# EasyEDA Pro project ProPrj_TC375_2025-11-27.epro, schematic SAL
Board Name: Board1; Create Date: 2025-11-19; Page Name: P1; Project Name: TC375; Schematic Name: SAL; Update Date: 2025-11-21; Company: 嘉立创EDA; Page Size: A4; Version: V1.0
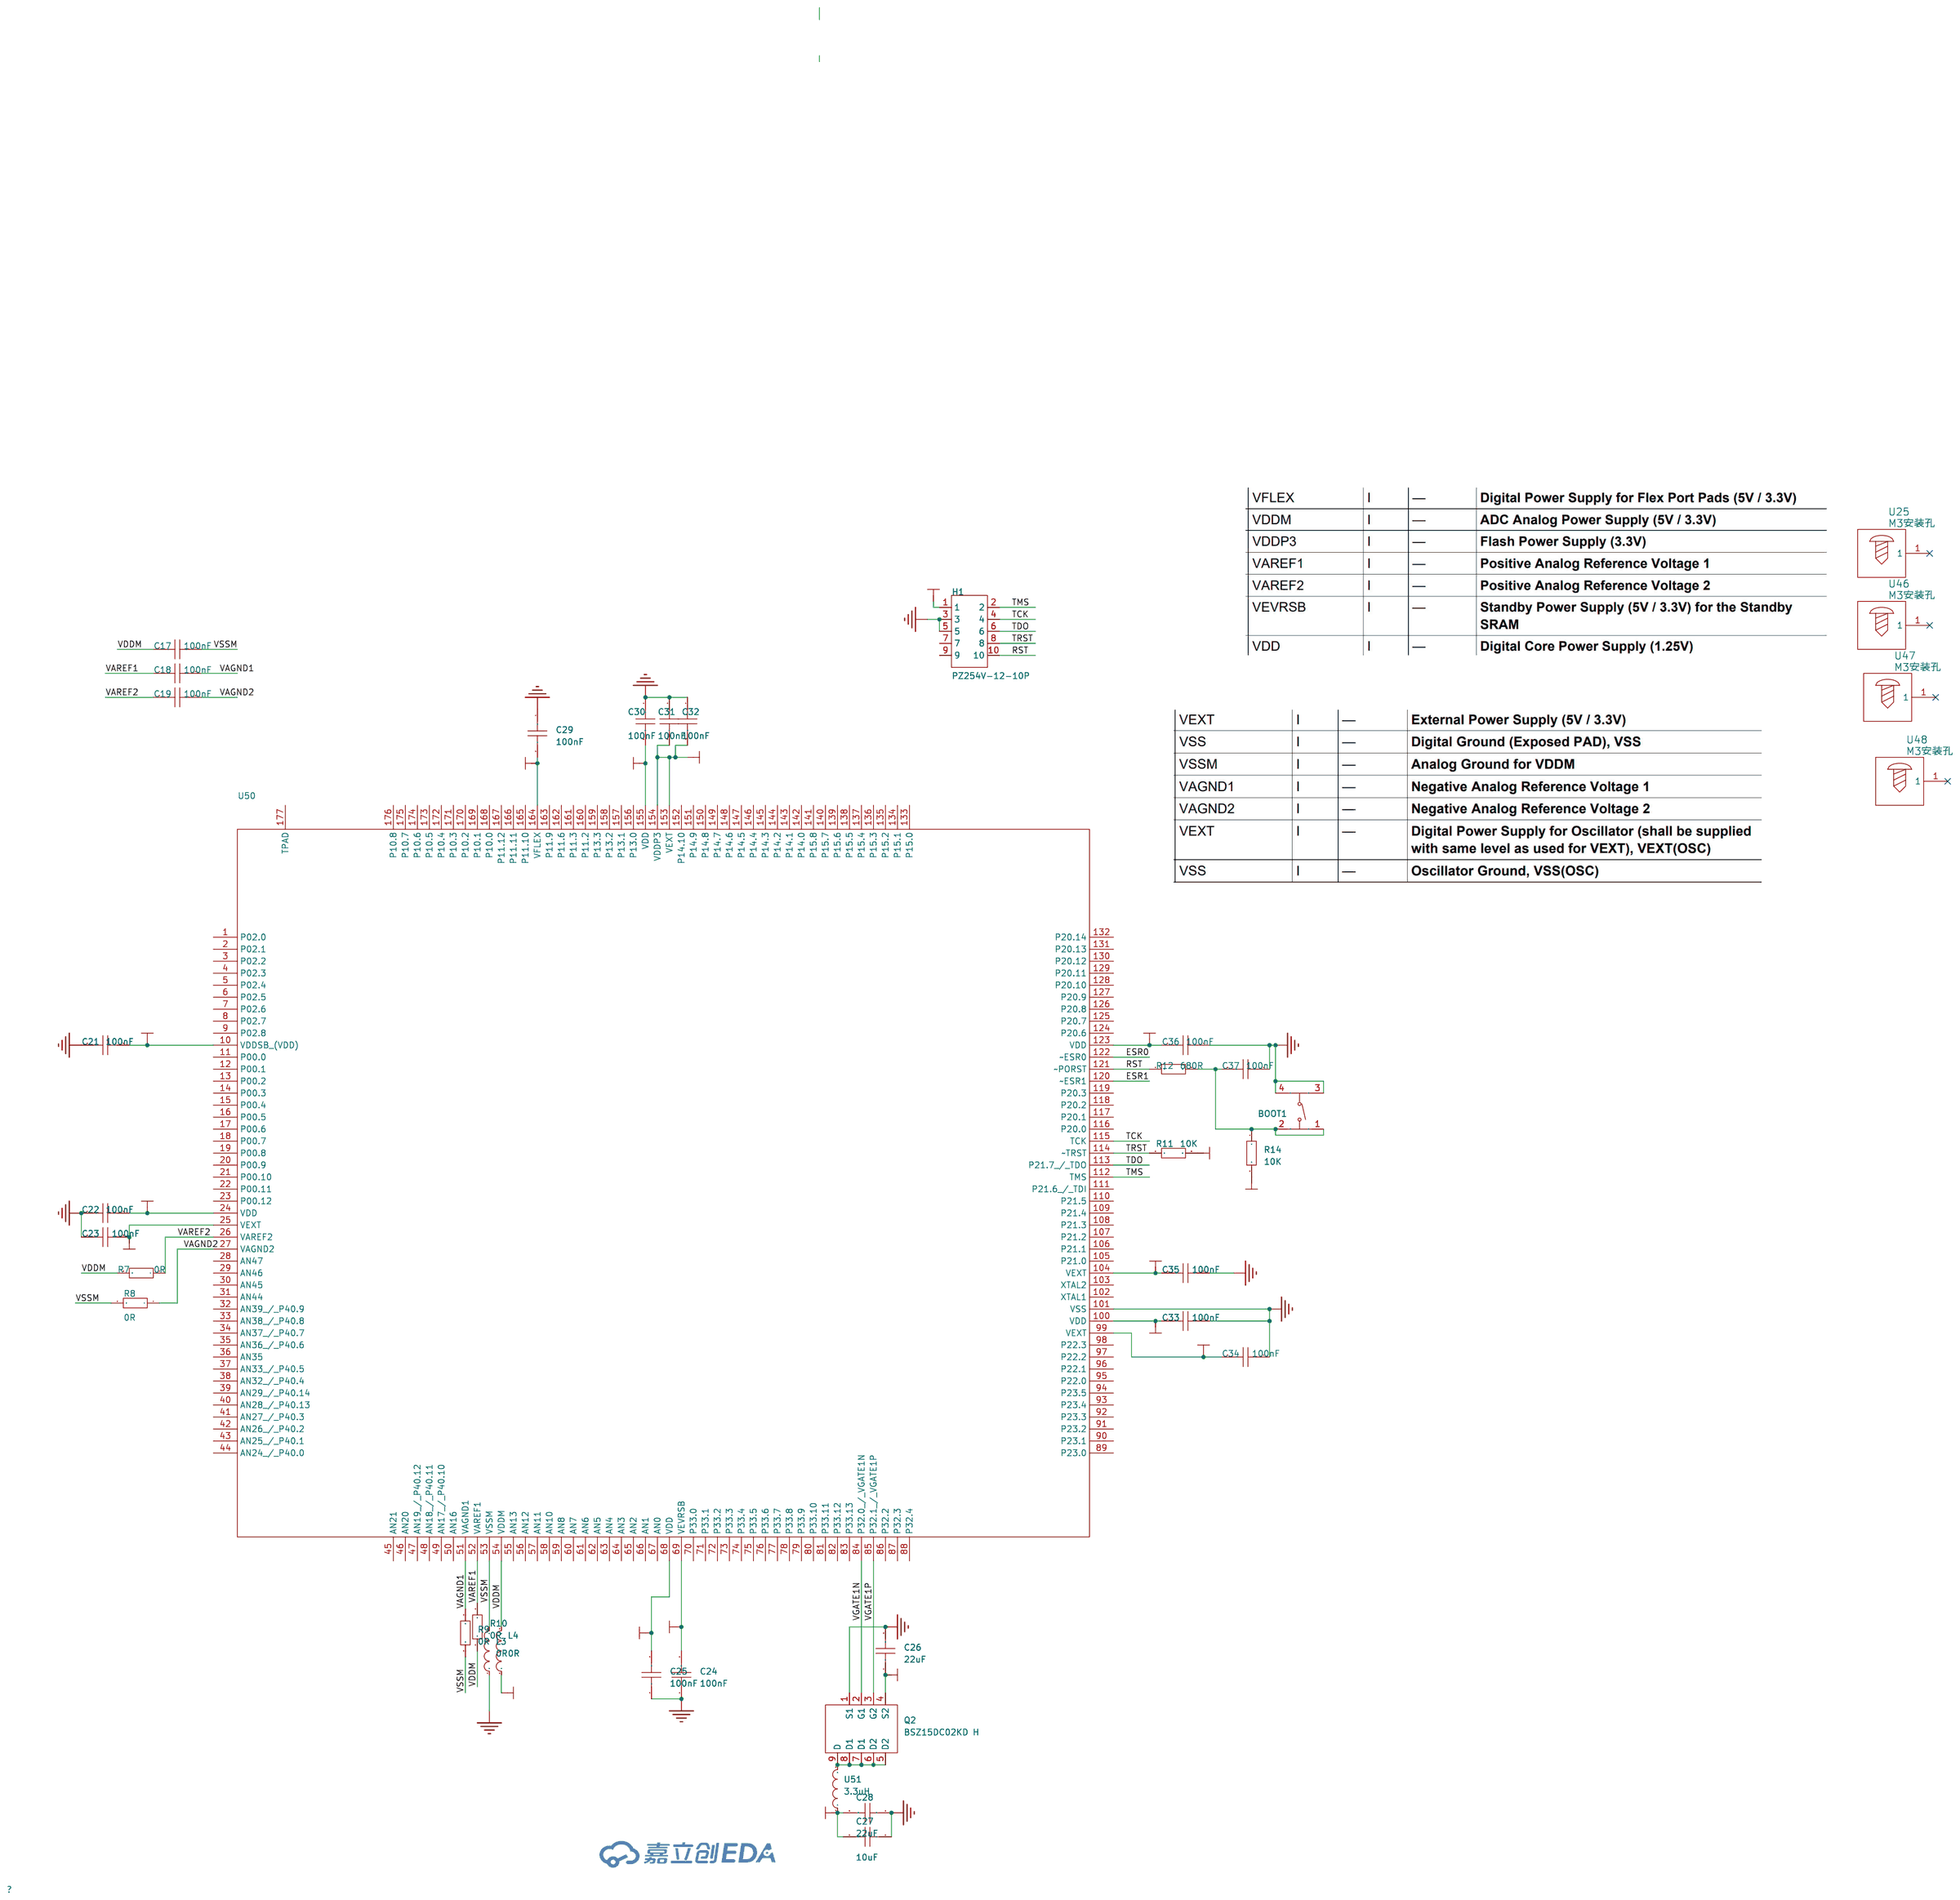
[diagram p0: schematic sheet]

## Parts
BOOT1  3*4*2.5mm 贴片4脚  [SW-SMD_4P-L4.2-W3.3-P2.15-LS5.1]
C17  100nF  [C0603]
C18  100nF  [C0603]
C19  100nF  [C0603]
C21  100nF  [C0603]
C22  100nF  [C0603]
C23  100nF  [C0603]
C24  100nF  [C0603]
C25  100nF  [C0603]
C26  22uF  [C0603]
C27  10uF  [C0603]
C28  22uF  [C0603]
C29  100nF  [C0603]
C30  100nF  [C0603]
C31  100nF  [C0603]
C32  100nF  [C0603]
C33  100nF  [C0603]
C34  100nF  [C0603]
C35  100nF  [C0603]
C36  100nF  [C0603]
C37  100nF  [C0603]
H1  PZ254V-12-10P  [HDR-TH_10P-P2.54-V-M-R2-C5-S2.54]
L3  0R  [L0603]
L4  0R  [L0603]
Q2  BSZ15DC02KD H  [PG-TSDSON-8_L3.3-W3.3-P0.65-BL]
R7  0R  [R0603]
R8  0R  [R0603]
R9  0R  [R0603]
R10  0R  [R0603]
R11  10K  [R0603]
R12  680R  [R0603]
R14  10K  [R0603]
U25  M3安装孔  [洞3MM]
U46  M3安装孔  [洞3MM]
U47  M3安装孔  [洞3MM]
U48  M3安装孔  [洞3MM]
U50  -  [LQFP-176_L24.0-W24.0-P0.50-LS26.0-BL-EP7.4]
U51  3.3uH  [IND-SMD_L2.0-W1.6]

## Library data of the parts
BOOT1 = 3*4*2.5mm 贴片4脚: Supplier Part: C9900020788; Supplier Footprint: SMD-4; JLCPCB Part Class: 扩展库; Datasheet: https://atta.szlcsc.comnull; Supplier: LCSC
C17-C19 C21-C25 C29-C37 = CAP_0603: Supplier Footprint: 0603
C26 C28 = CGA0603X5R226M100JT: 容值:22uF;精度:±20%;额定电压:10V;温度系数:X5R;; LCSC Part Name: 22uF ±20% 10V; Supplier Part: C6119863; Manufacturer: HRE(芯声); Supplier Footprint: 0603; JLCPCB Part Class: 扩展库; Datasheet: https://item.szlcsc.com/datasheet/CGA0603X5R226M100JT/7062569.html; Supplier: LCSC; Tolerance: ±20%; Voltage Rating: 10V; Temperature Coefficient: X5R
C27 = CGA0603X5R106K100JT: 容值:10uF;精度:±10%;额定电压:10V;温度系数:X5R;; LCSC Part Name: 10uF ±10% 10V; Supplier Part: C6119842; Manufacturer: HRE(芯声); Supplier Footprint: 0603; JLCPCB Part Class: 扩展库; Supplier: LCSC; Tolerance: ±10%; Voltage Rating: 10V; Temperature Coefficient: X5R
H1 = PZ254V-12-10P: 插针结构:2x5P;间距:2.54mm;行距:2.54mm;圆针/方针:方针;安装方式:直插;排数:双排;总PIN位数:10P;额定电流:-;额定电压:-;配合针长度:6mm;塑高:2.5mm;端接针长度:3mm;触头材质:黄铜;触头镀层:-;工作温度:-40℃~+105℃;颜色:黑色;; LCSC Part Name: 2x5P 间距:2.54mm 方针 直插; Supplier Part: C492422; Manufacturer: XFCN(兴飞); Supplier Footprint: 插件,P=2.54mm; JLCPCB Part Class: 扩展库; Datasheet: https://item.szlcsc.com/datasheet/PZ254V-12-10P/502978.html; Supplier: LCSC; Pin Structure: 2x5P; Pitch: 2.54mm; Row Spacing: 2.54mm; Circluar Pins/Square Pins: 方针; Mounting Type: 直插; Number of Rows: 双排; Number of Pins: 10P; Length of Mating Pin: 6mm; Insulation Height: 2.5mm; Length of End Connection Pin: 3mm; Contact Material: 黄铜; Operating Temperature: -40℃~+105℃; Color: 黑色
L3 L4 = CBG160808U000T: 阻抗@频率:0Ω@100MHz;直流电阻(DCR):100mΩ;; LCSC Part Name: 单路 0603磁珠 阻抗0Ω@100MHz; Supplier Part: C43163; Manufacturer: FH(风华); Supplier Footprint: 0603; JLCPCB Part Class: 扩展库; Datasheet: https://item.szlcsc.com/datasheet/CBG160808U000T/44154.html; Supplier: LCSC; Impedance @ Frequency: 0Ω@100MHz; DC Resistance(DCR): 100mΩ; Current Rating: 800mA; Number of Circuits: 1; Operating Temperature: -40℃~+85℃
Q2 = BSZ15DC02KD H: 类型:-;漏源电压(Vdss):-;连续漏极电流(Id):-;功率(Pd):-;导通电阻(RDS(on)@Vgs,Id):-;阈值电压(Vgs(th)@Id):-;; Supplier Part: C534710; Manufacturer: Infineon(英飞凌); Supplier Footprint: TSDSON-8(3.3x3.3); JLCPCB Part Class: 扩展库; Datasheet: https://atta.szlcsc.com/upload/public/pdf/source/20200519/C534710_F3CBDCD13CCB82028A5A6F9EF6190EE5.pdf; Supplier: LCSC
R7-R12 R14 = Res_0603: Supplier Footprint: 0603
U25 U46-U48 = M3安装孔
U50 = SAL-TC375TI-96F300W -200MHzTC375
U51 = APH201610T3R3M: 电感值:3.3uH;精度:±20%;额定电流:1.5A;饱和电流(Isat):2A;类型:一体成型电感;; LCSC Part Name: 3.3uH ±20% 2A 2x1.6x1mm; Supplier Part: C5349598; Manufacturer: APV(爱普微); Supplier Footprint: 0806; JLCPCB Part Class: 扩展库; Datasheet: https://item.szlcsc.com/datasheet/APH201610T3R3M/6135013.html; Supplier: LCSC; Tolerance: ±20%; Current Rating: 1.5A; Current - Saturation(Isat): 2A; DC Resistance(DCR): 180mΩ; Type: 一体成型电感

## Nets
GNDCORE: BOOT1.3 BOOT1.4 C21.1 C22.1 C23.1 C24.1 C25.1 C26.2 C27.1 C28.1 C29.1 C30.1 C31.1 C32.1 C33.1 C34.1 C35.1 C36.1 C37.1 H1.3 H1.5 L3.1 Q2.1(S1) U50.101(VSS)
VCC1V25: C21.2 C22.2 C25.2 C27.2 C28.2 C30.2 C33.2 C36.2 U50.10(VDDSB (VDD)) U50.24(VDD) U50.68(VDD) U50.100(VDD) U50.123(VDD) U50.155(VDD) U51.1
VCC3V3: C23.2 C24.2 C26.1 C29.2 C31.2 C32.2 C34.2 C35.2 H1.1 L4.1 Q2.4(S2) R11.2 R14.2 U50.25(VEXT) U50.69(VEVRSB) U50.99(VEXT) U50.104(VEXT) U50.153(VEXT) U50.154(VDDP3) U50.164(VFLEX)
VDDM: C17.1 L4.2 R7.2 R10.1 U50.54(VDDM)
VSSM: C17.2 L3.2 R8.2 R9.1 U50.53(VSSM)
ESR0: U50.122(~ESR0)
ESR1: U50.120(~ESR1)
RST: H1.10 R12.1 U50.121(~PORST)
TCK: H1.4 U50.115(TCK)
TDO: H1.6 U50.113(P21.7 / TDO)
TMS: H1.2 U50.112(TMS)
TRST: H1.8 R11.1 U50.114(~TRST)
VAGND1: C18.2 R9.2 U50.51(VAGND1)
VAGND2: C19.2 R8.1 U50.27(VAGND2)
VAREF1: C18.1 R10.2 U50.52(VAREF1)
VAREF2: C19.1 R7.1 U50.26(VAREF2)
VGATE1N: Q2.2(G1) U50.84(P32.0 / VGATE1N)
VGATE1P: Q2.3(G2) U50.85(P32.1 / VGATE1P)
$1N12248: Q2.5(D2) Q2.6(D2) Q2.7(D1) Q2.8(D1) Q2.9(D) U51.2
$1N12922: BOOT1.1 BOOT1.2 C37.2 R12.2 R14.1

Not connected (* = marked no-connect by the designer): H1 7 9; U25 1*; U46 1*; U47 1*; U48 1*; U50 1(P02.0) 2(P02.1) 3(P02.2) 4(P02.3) 5(P02.4) 6(P02.5) 7(P02.6) 8(P02.7) 9(P02.8) 11(P00.0) 12(P00.1) 13(P00.2) 14(P00.3) 15(P00.4) 16(P00.5) 17(P00.6) 18(P00.7) 19(P00.8) 20(P00.9) 21(P00.10) 22(P00.11) 23(P00.12) 28(AN47) 29(AN46) 30(AN45) 31(AN44) 32(AN39 / P40.9) 33(AN38 / P40.8) 34(AN37 / P40.7) 35(AN36 / P40.6) 36(AN35) 37(AN33 / P40.5) 38(AN32 / P40.4) 39(AN29 / P40.14) 40(AN28 / P40.13) 41(AN27 / P40.3) 42(AN26 / P40.2) 43(AN25 / P40.1) 44(AN24 / P40.0) 45(AN21) 46(AN20) 47(AN19 / P40.12) 48(AN18 / P40.11) 49(AN17 / P40.10) 50(AN16) 55(AN13) 56(AN12) 57(AN11) 58(AN10) 59(AN8) 60(AN7) 61(AN6) 62(AN5) 63(AN4) 64(AN3) 65(AN2) 66(AN1) 67(AN0) 70(P33.0) 71(P33.1) 72(P33.2) 73(P33.3) 74(P33.4) 75(P33.5) 76(P33.6) 77(P33.7) 78(P33.8) 79(P33.9) 80(P33.10) 81(P33.11) 82(P33.12) 83(P33.13) 86(P32.2) 87(P32.3) 88(P32.4) 89(P23.0) 90(P23.1) 91(P23.2) 92(P23.3) 93(P23.4) 94(P23.5) 95(P22.0) 96(P22.1) 97(P22.2) 98(P22.3) 102(XTAL1) 103(XTAL2) 105(P21.0) 106(P21.1) 107(P21.2) 108(P21.3) 109(P21.4) 110(P21.5) 111(P21.6 / TDI) 116(P20.0) 117(P20.1) 118(P20.2) 119(P20.3) 124(P20.6) 125(P20.7) 126(P20.8) 127(P20.9) 128(P20.10) 129(P20.11) 130(P20.12) 131(P20.13) 132(P20.14) 133(P15.0) 134(P15.1) 135(P15.2) 136(P15.3) 137(P15.4) 138(P15.5) 139(P15.6) 140(P15.7) 141(P15.8) 142(P14.0) 143(P14.1) 144(P14.2) 145(P14.3) 146(P14.4) 147(P14.5) 148(P14.6) 149(P14.7) 150(P14.8) 151(P14.9) 152(P14.10) 156(P13.0) 157(P13.1) 158(P13.2) 159(P13.3) 160(P11.2) 161(P11.3) 162(P11.6) 163(P11.9) 165(P11.10) 166(P11.11) 167(P11.12) 168(P10.0) 169(P10.1) 170(P10.2) 171(P10.3) 172(P10.4) 173(P10.5) 174(P10.6) 175(P10.7) 176(P10.8) 177(TPAD)
